# Altium schematic sheet Camera.SchDoc
size A3; Revision: 1.0; SheetNumber: 7; SheetTotal: 7
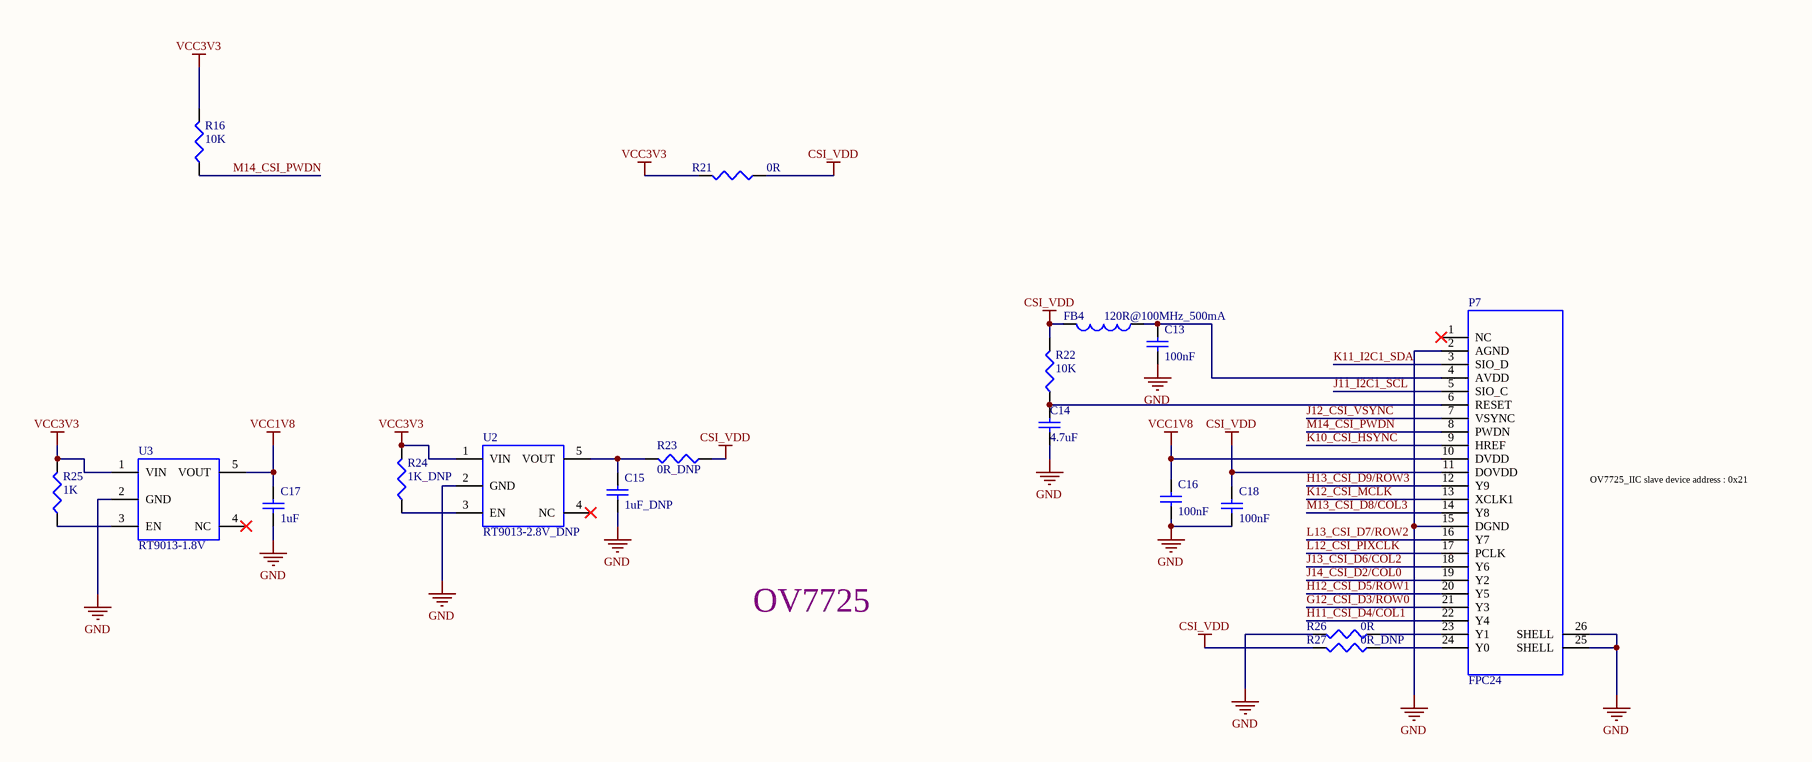
[diagram p0: Camera.SchDoc]

## Parts
C13  100nF  [0603C+]
C14  value 4.7uF  [0603C+]  (hidden comment: 0.1uF)
C15  1uF_DNP  [0603C+]
C16  value 100nF  [0603C+]  (hidden comment: 0.1uF)
C17  1uF  [0603C+]
C18  100nF  [0603C+]
FB4  120R@100MHz_500mA  [0603R+]
P7  FPC24  [FPC24]
R16  10K  [0603R+]
R21  0R  [0603R+]
R22  10K  [0603R+]
R23  0R_DNP  [0603R+]
R24  1K_DNP  [0603R+]
R25  1K  [0603R+]
R26  0R  [0603R+]
R27  0R_DNP  [0603R+]
U2  RT9013-2.8V_DNP  [SOT95P280X129-5N]
U3  RT9013-1.8V  [SOT95P280X129-5N]

## Nets
CSI_VDD: C18.1 FB4.2 P7.11(DOVDD) R21.1 R22.2 R23.1 R27.2
GND: C13.2 C14.2 C15.1 C16.2 C17.1 C18.2 P7.2(AGND) P7.15(DGND) P7.25(SHELL) P7.26(SHELL) R26.2 U2.2(GND) U3.2(GND)
VCC1V8: C16.1 C17.2 P7.10(DVDD) U3.5(VOUT)
VCC3V3: R16.2 R21.2 R24.2 R25.2 U2.1(VIN) U3.1(VIN)
G12_CSI_D3/ROW0: P7.21(Y3)
H11_CSI_D4/COL1: P7.22(Y4)
H12_CSI_D5/ROW1: P7.20(Y5)
H13_CSI_D9/ROW3: P7.12(Y9)
J11_I2C1_SCL: P7.5(SIO_C)
J12_CSI_VSYNC: P7.7(VSYNC)
J13_CSI_D6/COL2: P7.18(Y6)
J14_CSI_D2/COL0: P7.19(Y2)
K10_CSI_HSYNC: P7.9(HREF)
K11_I2C1_SDA: P7.3(SIO_D)
K12_CSI_MCLK: P7.13(XCLK1)
L12_CSI_PIXCLK: P7.17(PCLK)
L13_CSI_D7/ROW2: P7.16(Y7)
M13_CSI_D8/COL3: P7.14(Y8)
M14_CSI_PWDN: P7.8(PWDN) R16.1
NetC13_1: C13.1 FB4.1 P7.4(AVDD)
NetC14_1: C14.1 P7.6(RESET) R22.1
NetC15_2: C15.2 R23.2 U2.5(VOUT)
NetP7_23: P7.23(Y1) R26.1
NetP7_24: P7.24(Y0) R27.1
NetR24_1: R24.1 U2.3(EN)
NetR25_1: R25.1 U3.3(EN)

Not connected (* = marked no-connect by the designer): P7 1(NC)*; U2 4(NC)*; U3 4(NC)*

## Notes on the sheet
- (near P7) OV7725_IIC slave device address : 0x21
- OV7725
- 设计
- 审核
- 工艺
- 图纸名称
- 郝成东
- 批准
- 标准化
- 日期
- 版本
- 页码
- 第
- 页
- 共

## Library data of the parts
C13-C18 = Cap: Capacitor; Published: 8-Jun-2000; LatestRevisionDate: 17-Jul-2002; LatestRevisionNote: Re-released for DXP Platform.; PackageReference: RAD-0.3; Publisher: Altium Limited; PackageDescription: Radial Cap, Thru-Hole; 2 Leads; 0.3 in Pin Spacing
  C13 C18: Value: 100nF
  C15: Value: 1uF_DNP
  C17: Value: 1uF
FB4 = Inductor: Code_IEC: 1005; Published: 8-Jun-2000; LatestRevisionDate: 29-May-2009; LatestRevisionNote: IPC-7351 Footprint Added.; PackageReference: 0402-A; Publisher: Altium Limited; PackageDescription: Chip Inductor; Code_JEITA: 0402; Value: 120R@100MHz_500mA
P7 = CON24
R16 R21-R27 = Res3: Resistor; Published: 8-Jun-2000; LatestRevisionDate: 29-May-2009; LatestRevisionNote: IPC-7351 Footprint Added.; PackageReference: J1-0603; Publisher: Altium Limited; PackageDescription: Chip Resistor
  R16 R22: Value: 10K
  R21 R26: Value: 0R
  R23 R27: Value: 0R_DNP
  R24: Value: 1K_DNP
  R25: Value: 1K
U2 U3 = RT9013